# Altium schematic sheet Sheet1_MCU2.0.SchDoc: JJGEEX_Homie_POC1
size Legal; Author: Jonas Cooper; CompanyName: JJ-GEEX; DrawnBy: Jonas Cooper; Organization: Homie Secure Smarthome; Address1: -; Address2: CU Boulder ECEE; Address3: -; Address4: Capstone; DocumentNumber: 1; Revision: 1; SheetNumber: 1; SheetTotal: 4
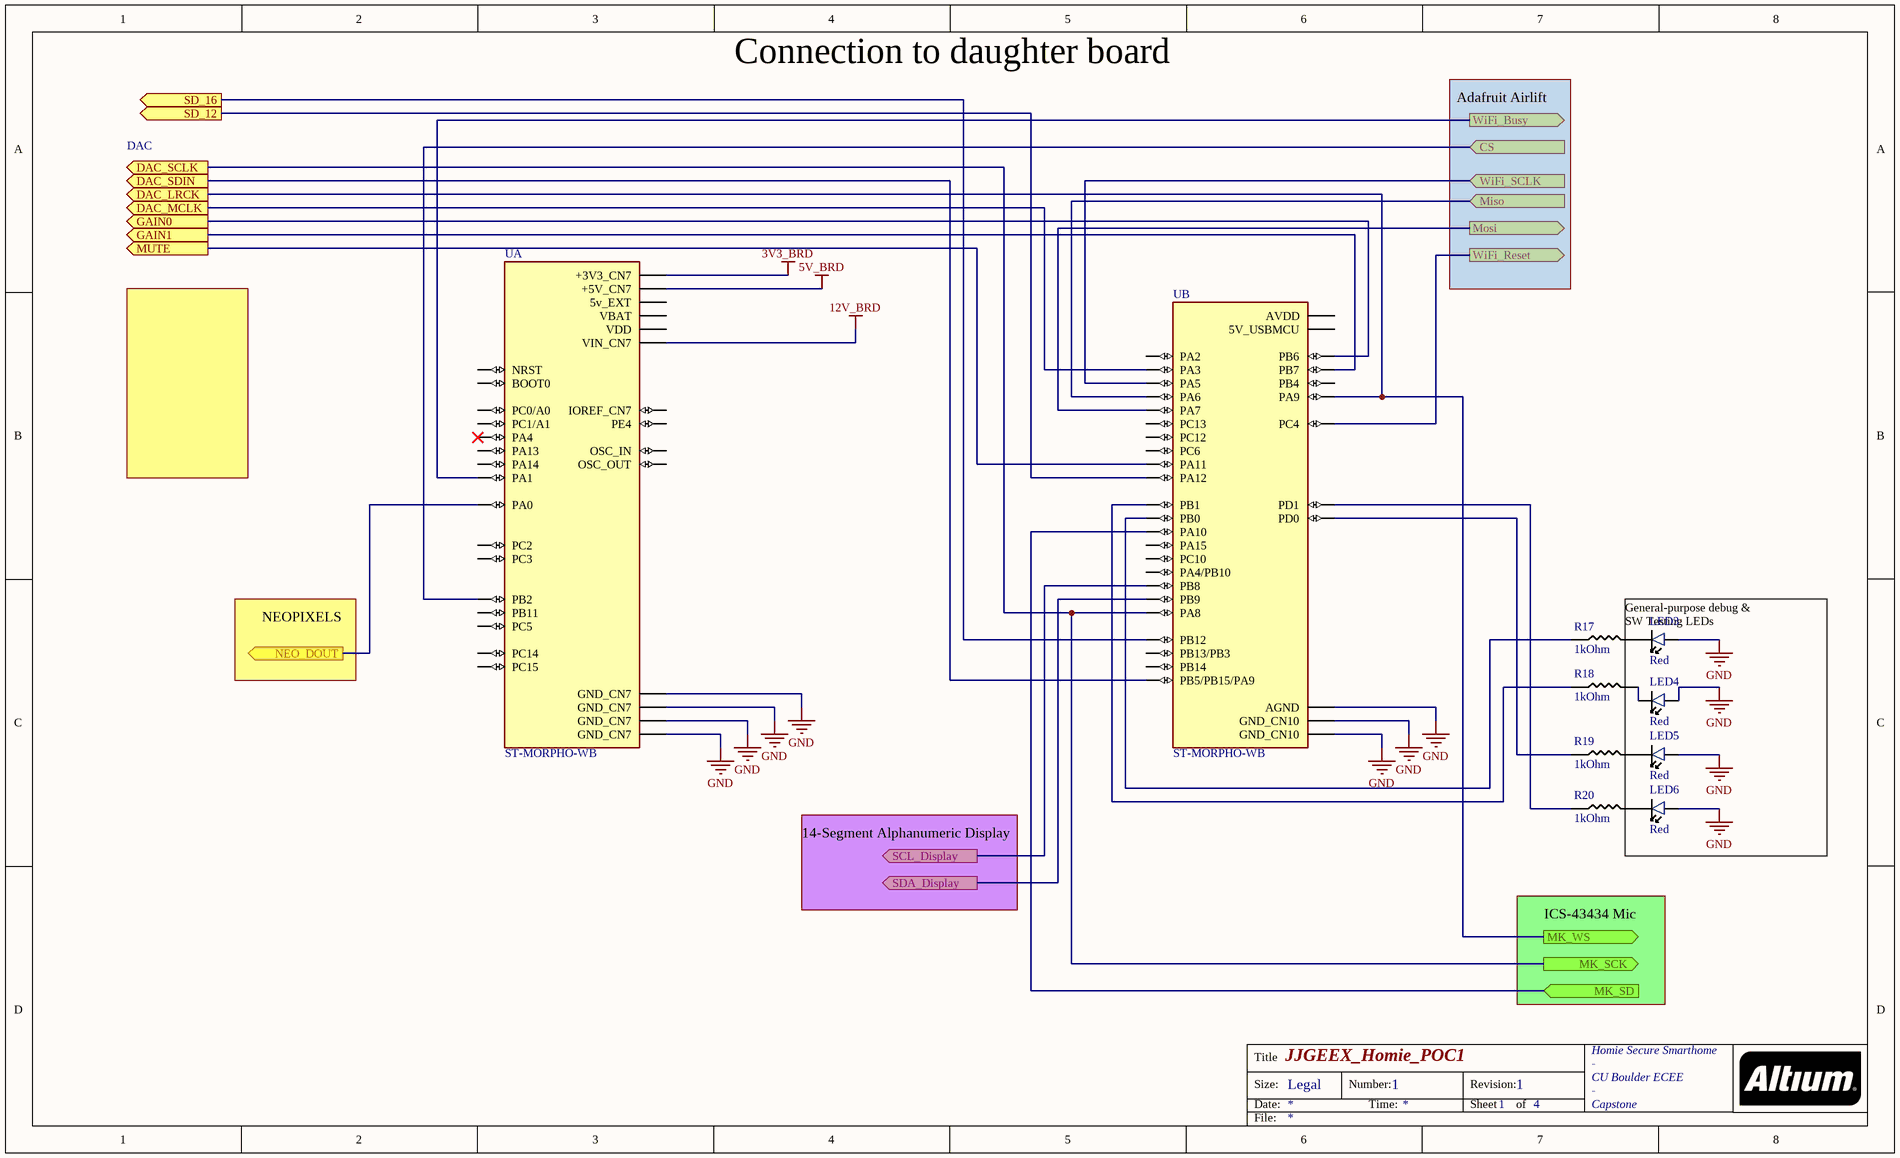
[diagram p0: Sheet1_MCU2.0.SchDoc]

## Parts
LED3  value Red  [LED0603-R-RD]  (hidden comment: KT-0603R)
LED4  value Red  [LED0603-R-RD]  (hidden comment: KT-0603R)
LED5  value Red  [LED0603-R-RD]  (hidden comment: KT-0603R)
LED6  value Red  [LED0603-R-RD]  (hidden comment: KT-0603R)
R17  value 1kOhm  [R0603]  (hidden comment: 1 kOhm)
R18  value 1kOhm  [R0603]  (hidden comment: 1 kOhm)
R19  value 1kOhm  [R0603]  (hidden comment: 1 kOhm)
R20  value 1kOhm  [R0603]  (hidden comment: 1 kOhm)
U  ST-MORPHO-WB  [ST-MORPHO-WB]  (parts A,B of 2)

## Ports
CS (in), DAC_LRCK (out), DAC_MCLK (out), DAC_SCLK (out), DAC_SDIN (out), GAIN0 (out), GAIN1 (out), Miso (in), MK_SCK (out), MK_SD (in), MK_WS (out), Mosi (out), MUTE (out), NEO_DOUT (out), SCL_Display (out), SD_12 (out), SD_16 (out), SDA_Display (out), WiFi_Busy (out), WiFi_Reset (out), WiFi_SCLK (in)

## Nets
3V3_BRD: U.CN7_16(+3V3_CN7)
5V_BRD: U.CN7_18(+5V_CN7)
12V_BRD: U.CN7_24(VIN_CN7)
GND: LED3.2 LED4.2 LED5.2 LED6.2 U.CN7_8(GND_CN7) U.CN7_19(GND_CN7) U.CN7_20(GND_CN7) U.CN7_22(GND_CN7) U.CN10_9(GND_CN10) U.CN10_20(GND_CN10) U.CN10_32(AGND)
CS: U.CN7_2(PB2) ; port CS
DAC_LRCK: U.CN10_19(PA9) ; port MK_WS, port DAC_LRCK
DAC_MCLK: U.CN10_37(PA3) ; port DAC_MCLK
DAC_SCLK: U.CN10_25(PA8) ; port MK_SCK, port DAC_SCLK
DAC_SDIN: U.CN10_26(PB5/PB15/PA9) ; port DAC_SDIN
GAIN0: U.CN10_34(PB6) ; port GAIN0
GAIN1: U.CN10_6(PB7) ; port GAIN1
Miso: U.CN10_13(PA6) ; port Miso
MK_SD: U.CN10_31(PA10) ; port MK_SD
Mosi: U.CN10_15(PA7) ; port Mosi
MUTE: U.CN10_14(PA11) ; port MUTE
NEO_DOUT: U.CN7_34(PA0) ; port NEO_DOUT
SCL_Display: U.CN10_3(PB8) ; port SCL_Display
SD_12: U.CN10_12(PA12) ; port SD_12
SD_16: U.CN10_16(PB12) ; port SD_16
SDA_Display: U.CN10_5(PB9) ; port SDA_Display
WiFi_Busy: U.CN7_32(PA4) ; port WiFi_Busy
WiFi_Reset: U.CN10_1(PC4) ; port WiFi_Reset
WiFi_SCLK: U.CN10_11(PA5) ; port WiFi_SCLK
NetLED3_1: LED3.1 R17.2
NetLED4_1: LED4.1 R18.2
NetLED5_1: LED5.1 R19.2
NetLED6_1: LED6.1 R20.2
NetR17_1: R17.1 U.CN10_22(PB0)
NetR18_1: R18.1 U.CN10_24(PB1)
NetR19_1: R19.1 U.CN10_36(PD0)
NetR20_1: R20.1 U.CN10_38(PD1)

Not connected (* = marked no-connect by the designer): U CN7_1(PB11) CN7_3(PC5) CN7_4(PE4) CN7_5(VDD) CN7_6(5v_EXT) CN7_7(BOOT0) CN7_12(IOREF_CN7) CN7_13(PA13) CN7_14(NRST) CN7_15(PA14) CN7_25(PC14) CN7_27(PC15) CN7_28(PC0/A0) CN7_29(OSC_IN) CN7_30(PC1/A1) CN7_31(OSC_OUT) CN7_33(VBAT) CN7_36(PC3) CN7_38(PC2) CN10_4(PB4) CN10_7(AVDD) CN10_8(5V_USBMCU) CN10_17(PA4/PB10) CN10_21(PC12) CN10_23(PC13) CN10_27(PA15) CN10_28(PB14) CN10_29(PC10) CN10_30(PB13/PB3) CN10_33(PC6) CN10_35(PA2)

## Notes on the sheet
- Connection to daughter board
- Adafruit Airlift
- DAC
- NEOPIXELS
- 14-Segment Alphanumeric Display
- General-purpose debug &
  SW Testing LEDs
- ICS-43434 Mic
- Title
- Size:
- Date:
- Legal
- Number:
- Time:
- Revision:
- Sheet
- of
- File:

## Library data of the parts
LED3-LED6 = LED_RED_0603: LIGHT EMITTING DIODES (LED) RED 520~625NM 90~100MCD@20MA TOP VIEW 0603 ROHS; MFR: Hubei KENTO Elec; MFR#: KT-0603R; LCSC#: C2286
R17-R20 = R_1kOhm_0603: 1kOhm +-1%  0603; MFR: Uniroyal; Mfr#: 0603WAF1001T5E; LCSC#: 21190
U = ST-MORPHO-WB: P-NUCLEO-WB55 Header Footprint; MF: STMicroelectronics; MP: NUCLEO-F030R8; Package: TSOT-23 STMicroelectronics; Price: None; SnapEDA_Link: https://www.snapeda.com/parts/NUCLEO-F030R8/STMicroelectronics/view-part/240805/?ref=snap; Availability: Unavailable; Value: *